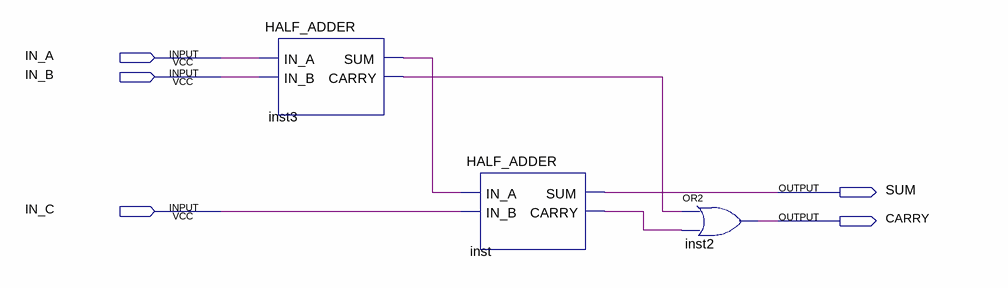
[diagram p0: schematic sheet]
// Quartus schematic FULL_ADDER_1.bdf as structural Verilog: 3 symbols, 5 pins
module FULL_ADDER_1 (
  input  IN_A,
  input  IN_B,
  input  IN_C,
  output SUM,
  output CARRY
);

  wire inst3_carry, inst3_sum, inst_carry;

  HALF_ADDER inst3 (.IN_A(IN_A), .IN_B(IN_B), .SUM(inst3_sum), .CARRY(inst3_carry));
  HALF_ADDER inst (.IN_A(inst3_sum), .IN_B(IN_C), .SUM(SUM), .CARRY(inst_carry));
  or inst2 (CARRY, inst3_carry, inst_carry);
endmodule
